# Altium schematic sheet CAN.SchDoc
size A
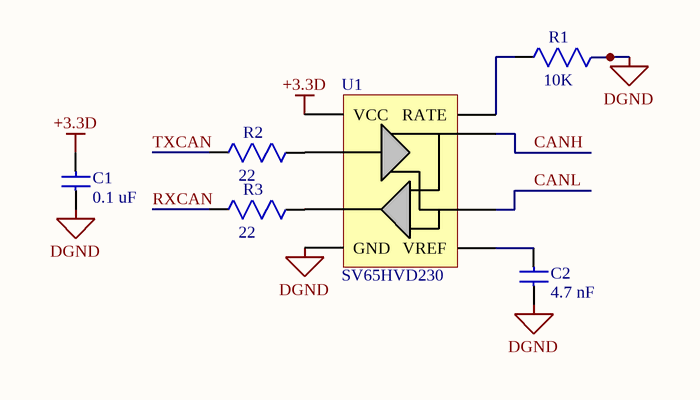
[diagram p0: CAN.SchDoc]

## Parts
C1  value 0.1 uF  [0805]  (hidden comment: CAP 0.1uF)
C2  value 4.7 nF  [0805]  (hidden comment: CAP 4.7nF)
R1  value 10K  [0805]  (hidden comment: R_0805_10k_1%)
R2  value 22  [0805]  (hidden comment: R_0805_22_1%)
R3  value 22  [0805]  (hidden comment: R_0805_22_1%)
U1  value SV65HVD230  [SOIC127P600-8N]  (hidden comment: U_SN65HVD230)

## Nets
+3.3D: C1.1 U1.3(VCC)
DGND: C1.2 C2.2 R1.1 U1.2(GND)
CANH: U1.7(CANH)
CANL: U1.6(CANL)
RXCAN: R3.2
TXCAN: R2.2
NetC2_1: C2.1 U1.5(VREF)
NetR1_2: R1.2 U1.8(RATE)
NetR2_1: R2.1 U1.1(TXD)
NetR3_1: R3.1 U1.4(RXD)

## Library data of the parts
C1 = C_0805_0.1uF_1: CAP CERM 0.1uF; Manufacturer: Yageo; Manufacturer PN: CC0805ZRY5V9BB104; SVP Creator: Brett Paulsen; Package: 0805; Known Distributors: Digikey; ComponentLink1Description: Datasheet; ComponentLink1URL: SVN Datasheet URL; Price: .028
C2 = C_0805_4.7nF: CAP CERM 4.7NF; SVP Creator: Jonathan Nutzmann; Package: 0805; Known Distributors: Digikey; ComponentLink1Description: Datasheet; ComponentLink1URL: SVN Datasheet URL
R1 = R_0805_10K_1%: RES 10K OHM 1/8W 1% 0805 SMD; Power Rating: .125W; SVP Creator: Jonathan Nutzmann; Package: 0805; Known Distributor: Digikey; ComponentLink1Description: Datasheet
R2 R3 = R_0805_22_1%: RES 22 OHM 1/8W 1% 0805 SMD; Power Rating: .125W; SVP Creator: Jonathan Nutzmann; Package: 0805; Known Distributor: Digikey; ComponentLink1Description: Datasheet
U1 = U_SN65HVD230: CAN Transciever; Manufacturer: Texas Insturments; SVP Creator: Jonathan Nutzmann; Package: SOIC-8; Known Distributors: DigiKey; Manufacturer PN: SV65HVD230; HelpURL: http://umnsvp.dyndns.org/svn/centaurus2/datasheets/Common Board/sn65hvd251.pdf; ComponentLink1URL: http://umnsvp.dyndns.org/svn/centaurus2/datasheets/Common Board/sn65hvd251.pdf; ComponentLink1Description: Datasheet